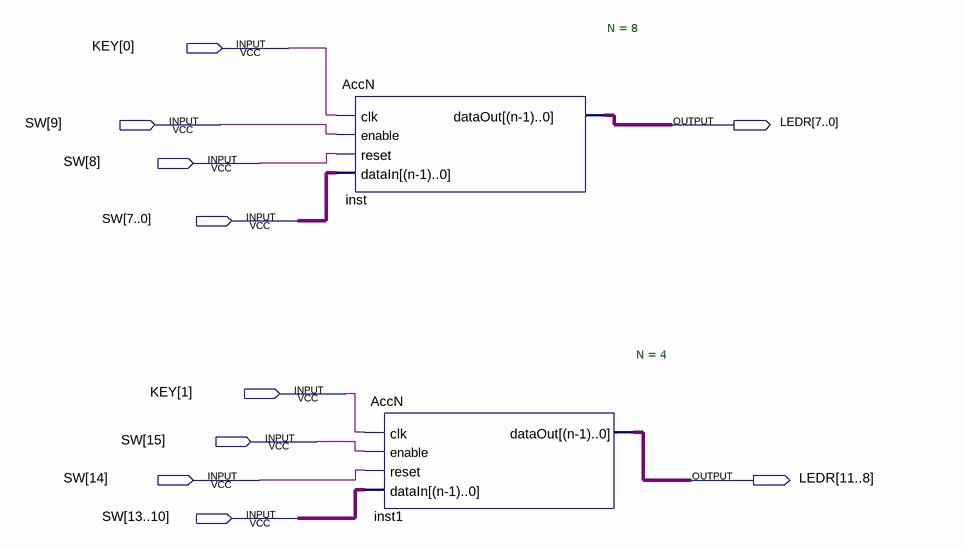
[diagram p0: schematic sheet]
// Quartus schematic AccN_Demo.bdf as structural Verilog: 2 symbols, 10 pins
module AccN_Demo (
  input  [1:0] KEY,
  input  [15:0] SW,
  output [11:0] LEDR
);

  AccN #(.N(8)) inst (.clk(KEY[0]), .enable(SW[9]), .reset(SW[8]), .dataIn(SW[7:0]), .dataOut(LEDR[7:0]));
  AccN #(.N(4)) inst1 (.clk(KEY[1]), .enable(SW[15]), .reset(SW[14]), .dataIn(SW[13:10]), .dataOut(LEDR[11:8]));
endmodule
